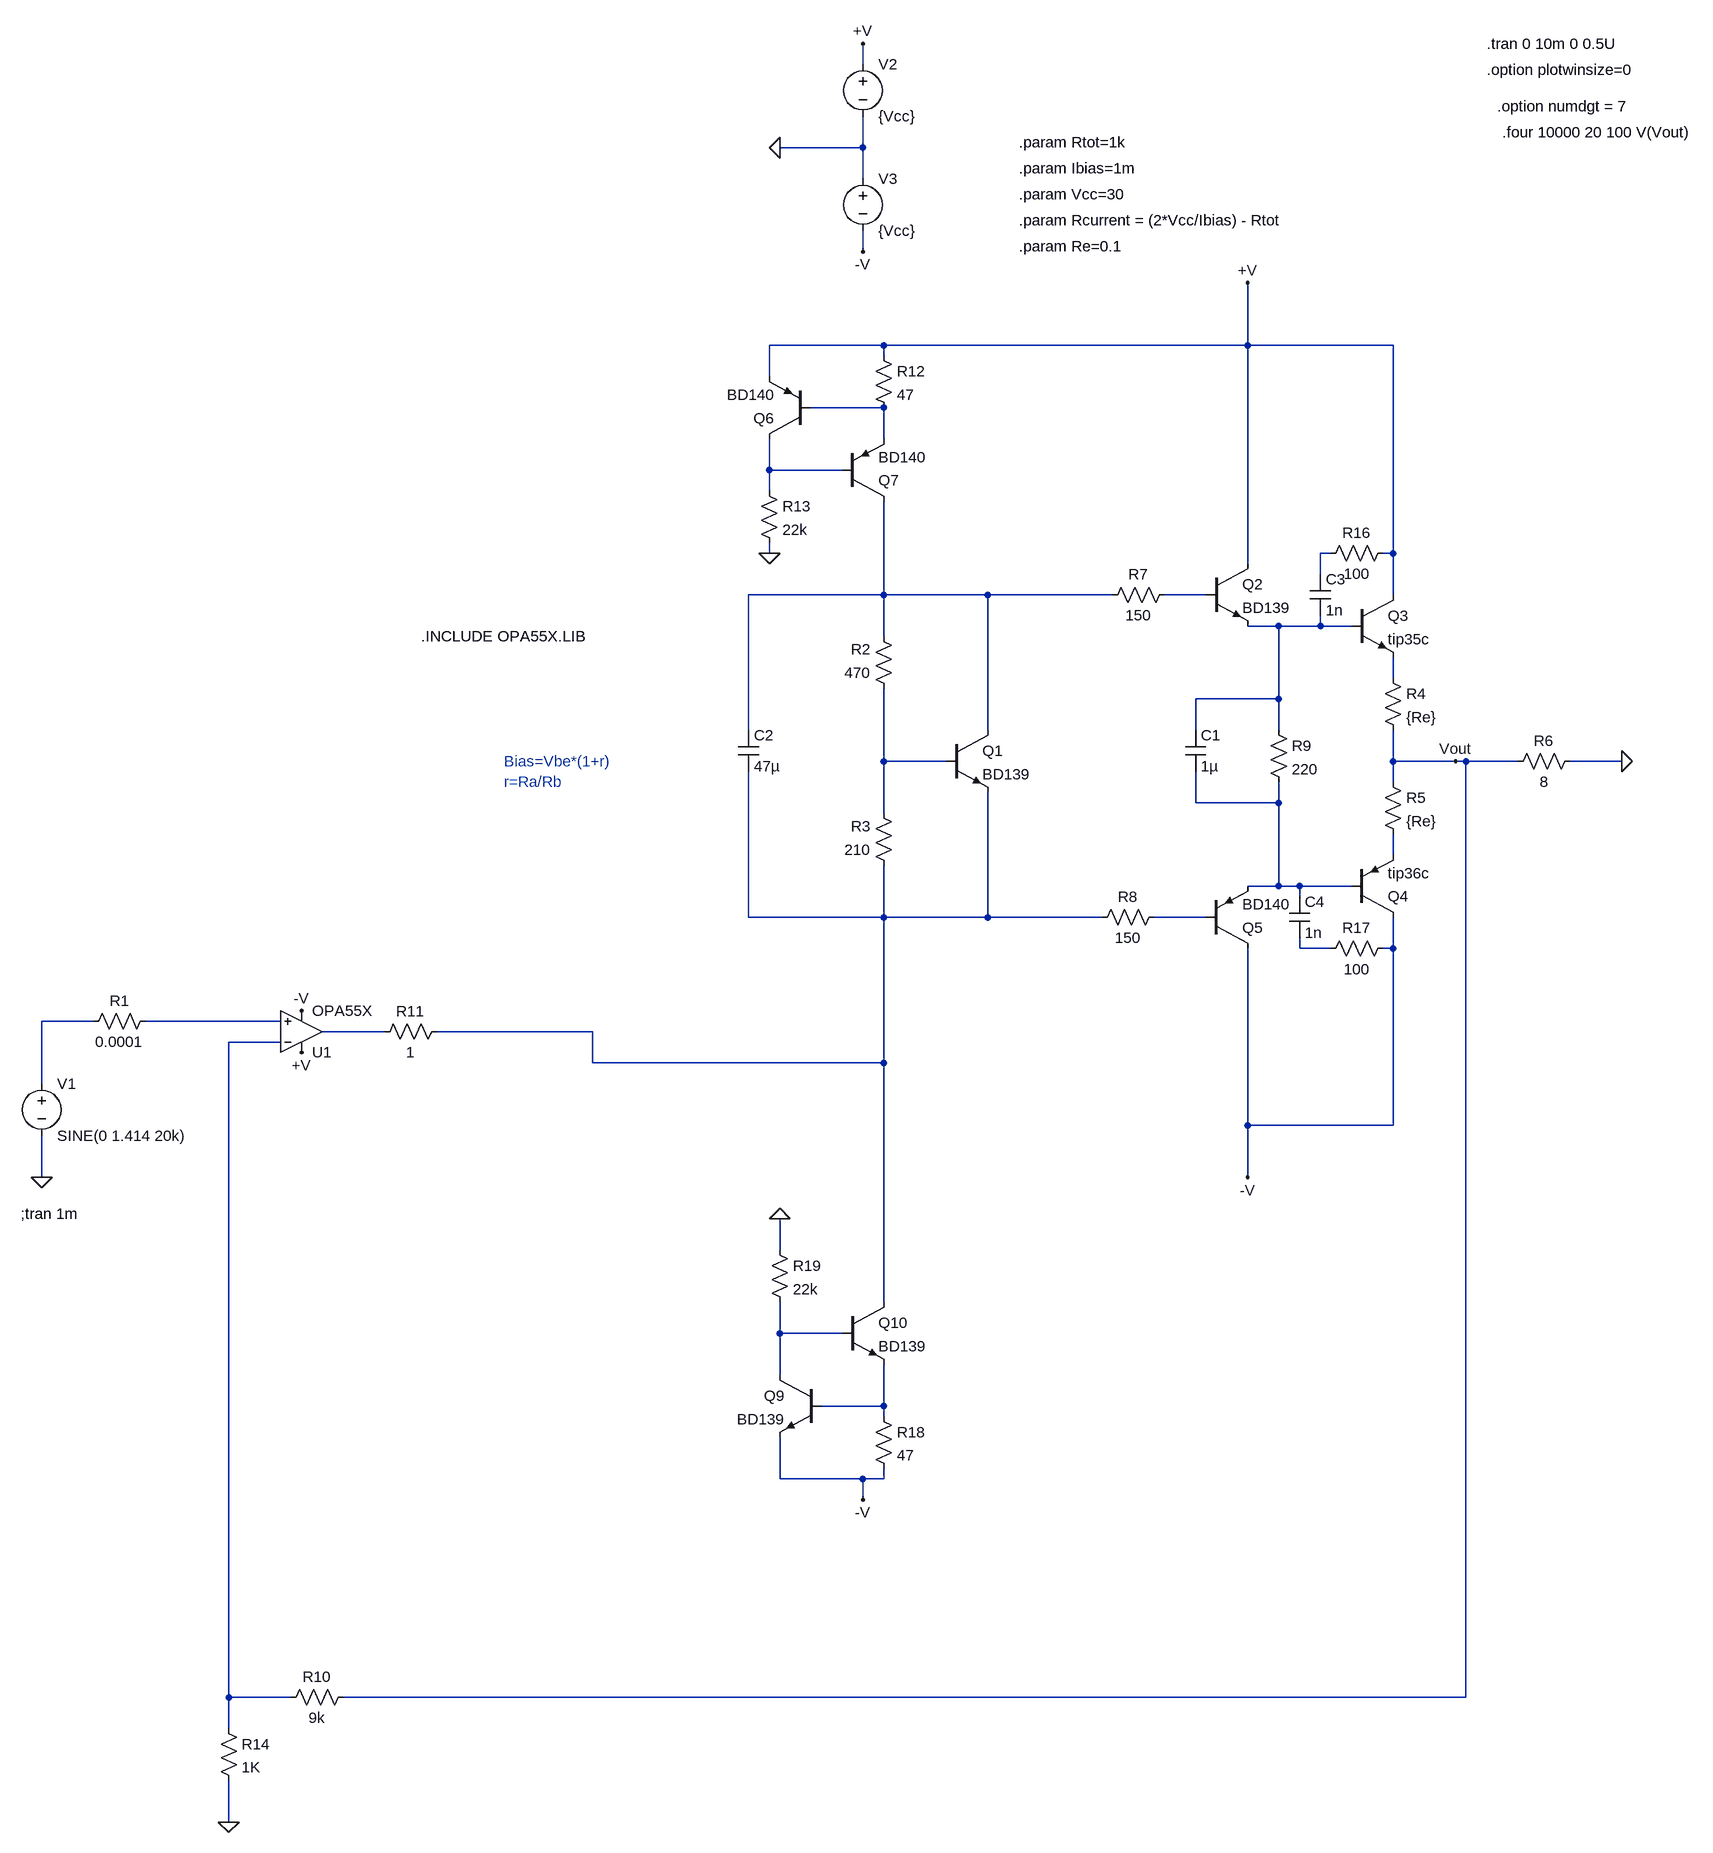
[diagram p0: schematic V3 OFFSET - POWER.asc]
V3 OFFSET - POWER.asc, the LTspice schematic file:
Version 4
SHEET 1 1624 1316
WIRE 320 -2688 320 -2720
WIRE 320 -2560 320 -2608
WIRE 320 -2560 192 -2560
WIRE 320 -2512 320 -2560
WIRE 320 -2400 320 -2432
WIRE 352 -2256 176 -2256
WIRE 912 -2256 912 -2352
WIRE 912 -2256 352 -2256
WIRE 1136 -2256 912 -2256
WIRE 352 -2240 352 -2256
WIRE 176 -2208 176 -2256
WIRE 352 -2160 240 -2160
WIRE 352 -2112 352 -2160
WIRE 176 -2064 176 -2112
WIRE 288 -2064 176 -2064
WIRE 176 -2032 176 -2064
WIRE 176 -1936 176 -1952
WIRE 1040 -1936 1024 -1936
WIRE 1136 -1936 1136 -2256
WIRE 1136 -1936 1120 -1936
WIRE 912 -1920 912 -2256
WIRE 1024 -1904 1024 -1936
WIRE 352 -1872 352 -2016
WIRE 352 -1872 144 -1872
WIRE 512 -1872 352 -1872
WIRE 704 -1872 512 -1872
WIRE 848 -1872 784 -1872
WIRE 1136 -1872 1136 -1936
WIRE 960 -1824 912 -1824
WIRE 1024 -1824 1024 -1840
WIRE 1024 -1824 960 -1824
WIRE 1072 -1824 1024 -1824
WIRE 352 -1808 352 -1872
WIRE 1136 -1744 1136 -1776
WIRE 960 -1712 960 -1824
WIRE 960 -1712 832 -1712
WIRE 144 -1664 144 -1872
WIRE 512 -1664 512 -1872
WIRE 832 -1664 832 -1712
WIRE 960 -1664 960 -1712
WIRE 352 -1616 352 -1728
WIRE 448 -1616 352 -1616
WIRE 1136 -1616 1136 -1664
WIRE 1232 -1616 1136 -1616
WIRE 1248 -1616 1232 -1616
WIRE 1328 -1616 1248 -1616
WIRE 1488 -1616 1408 -1616
WIRE 1136 -1584 1136 -1616
WIRE 832 -1552 832 -1600
WIRE 960 -1552 960 -1584
WIRE 960 -1552 832 -1552
WIRE 352 -1536 352 -1616
WIRE 1136 -1472 1136 -1504
WIRE 960 -1424 960 -1552
WIRE 960 -1424 912 -1424
WIRE 992 -1424 960 -1424
WIRE 1072 -1424 992 -1424
WIRE 992 -1408 992 -1424
WIRE 144 -1376 144 -1600
WIRE 352 -1376 352 -1456
WIRE 352 -1376 144 -1376
WIRE 512 -1376 512 -1568
WIRE 512 -1376 352 -1376
WIRE 688 -1376 512 -1376
WIRE 848 -1376 768 -1376
WIRE 992 -1328 992 -1344
WIRE 1040 -1328 992 -1328
WIRE 1136 -1328 1136 -1376
WIRE 1136 -1328 1120 -1328
WIRE -864 -1216 -944 -1216
WIRE -576 -1216 -784 -1216
WIRE -416 -1200 -512 -1200
WIRE -96 -1200 -336 -1200
WIRE -576 -1184 -656 -1184
WIRE -96 -1152 -96 -1200
WIRE 352 -1152 352 -1376
WIRE 352 -1152 -96 -1152
WIRE -944 -1120 -944 -1216
WIRE 912 -1056 912 -1328
WIRE 1136 -1056 1136 -1328
WIRE 1136 -1056 912 -1056
WIRE -944 -976 -944 -1040
WIRE 912 -976 912 -1056
WIRE 192 -864 192 -912
WIRE 352 -784 352 -1152
WIRE 192 -736 192 -784
WIRE 288 -736 192 -736
WIRE 192 -672 192 -736
WIRE 352 -624 352 -688
WIRE 352 -624 256 -624
WIRE 352 -608 352 -624
WIRE 192 -512 192 -576
WIRE 320 -512 192 -512
WIRE 352 -512 352 -528
WIRE 352 -512 320 -512
WIRE 320 -480 320 -512
WIRE -656 -176 -656 -1184
WIRE -560 -176 -656 -176
WIRE 1248 -176 1248 -1616
WIRE 1248 -176 -480 -176
WIRE -656 -128 -656 -176
WIRE -656 16 -656 -48
FLAG 912 -2352 +V
FLAG 912 -976 -V
FLAG -944 -976 0
FLAG 192 -2560 0
FLAG 320 -2720 +V
FLAG 320 -2400 -V
FLAG 1488 -1616 0
FLAG 1232 -1616 Vout
FLAG -544 -1168 +V
FLAG -544 -1232 -V
FLAG 176 -1936 0
FLAG -656 16 0
FLAG 192 -912 0
FLAG 320 -480 -V
SYMBOL voltage -944 -1136 R0
WINDOW 123 0 0 Left 0
WINDOW 39 0 0 Left 0
SYMATTR InstName V1
SYMATTR Value SINE(0 1.414 20k)
SYMBOL res -768 -1232 R90
WINDOW 0 0 56 VBottom 2
WINDOW 3 32 56 VTop 2
SYMATTR InstName R1
SYMATTR Value 0.0001
SYMBOL res 368 -1712 R180
WINDOW 0 36 76 Left 2
WINDOW 3 36 40 Left 2
SYMATTR InstName R2
SYMATTR Value 470
SYMBOL res 368 -1440 R180
WINDOW 0 36 76 Left 2
WINDOW 3 36 40 Left 2
SYMATTR InstName R3
SYMATTR Value 210
SYMBOL npn 448 -1664 R0
SYMATTR InstName Q1
SYMATTR Value BD139
SYMBOL npn 848 -1920 R0
SYMATTR InstName Q2
SYMATTR Value BD139
SYMBOL npn 1072 -1872 R0
SYMATTR InstName Q3
SYMATTR Value tip35c
SYMBOL pnp 1072 -1376 M180
SYMATTR InstName Q4
SYMATTR Value tip36c
SYMBOL pnp 848 -1328 M180
SYMATTR InstName Q5
SYMATTR Value BD140
SYMBOL res 1120 -1760 R0
SYMATTR InstName R4
SYMATTR Value {Re}
SYMBOL res 1120 -1600 R0
SYMATTR InstName R5
SYMATTR Value {Re}
SYMBOL voltage 320 -2704 R0
WINDOW 123 0 0 Left 0
WINDOW 39 0 0 Left 0
SYMATTR InstName V2
SYMATTR Value {Vcc}
SYMBOL voltage 320 -2528 R0
WINDOW 123 0 0 Left 0
WINDOW 39 0 0 Left 0
SYMATTR InstName V3
SYMATTR Value {Vcc}
SYMBOL res 1424 -1632 R90
WINDOW 0 0 56 VBottom 2
WINDOW 3 32 56 VTop 2
SYMATTR InstName R6
SYMATTR Value 8
SYMBOL res 800 -1888 R90
WINDOW 0 0 56 VBottom 2
WINDOW 3 32 56 VTop 2
SYMATTR InstName R7
SYMATTR Value 150
SYMBOL res 784 -1392 R90
WINDOW 0 0 56 VBottom 2
WINDOW 3 32 56 VTop 2
SYMATTR InstName R8
SYMATTR Value 150
SYMBOL res 944 -1680 R0
SYMATTR InstName R9
SYMATTR Value 220
SYMBOL cap 816 -1664 R0
SYMATTR InstName C1
SYMATTR Value 1µ
SYMBOL cap 128 -1664 R0
SYMATTR InstName C2
SYMATTR Value 47µ
SYMBOL OpAmps\\opamp2 -544 -1136 M180
SYMATTR InstName U1
SYMATTR Value OPA55X
SYMBOL res -464 -192 R90
WINDOW 0 0 56 VBottom 2
WINDOW 3 32 56 VTop 2
SYMATTR InstName R10
SYMATTR Value 9k
SYMBOL res -320 -1216 R90
WINDOW 0 0 56 VBottom 2
WINDOW 3 32 56 VTop 2
SYMATTR InstName R11
SYMATTR Value 1
SYMBOL pnp 240 -2112 R180
SYMATTR InstName Q6
SYMATTR Value BD140
SYMBOL res 336 -2256 R0
SYMATTR InstName R12
SYMATTR Value 47
SYMBOL pnp 288 -2016 M180
SYMATTR InstName Q7
SYMATTR Value BD140
SYMBOL res 160 -2048 R0
SYMATTR InstName R13
SYMATTR Value 22k
SYMBOL res -672 -144 R0
SYMATTR InstName R14
SYMATTR Value 1K
SYMBOL cap 1008 -1904 R0
SYMATTR InstName C3
SYMATTR Value 1n
SYMBOL res 1136 -1952 R90
WINDOW 0 0 56 VBottom 2
WINDOW 3 32 56 VTop 2
SYMATTR InstName R16
SYMATTR Value 100
SYMBOL res 1136 -1344 R90
WINDOW 0 0 56 VBottom 2
WINDOW 3 32 56 VTop 2
SYMATTR InstName R17
SYMATTR Value 100
SYMBOL cap 976 -1408 R0
SYMATTR InstName C4
SYMATTR Value 1n
SYMBOL npn 256 -672 M0
SYMATTR InstName Q9
SYMATTR Value BD139
SYMBOL npn 288 -784 R0
SYMATTR InstName Q10
SYMATTR Value BD139
SYMBOL res 336 -624 R0
SYMATTR InstName R18
SYMATTR Value 47
SYMBOL res 176 -880 R0
SYMATTR InstName R19
SYMATTR Value 22k
TEXT -232 -1616 Left 2 ;Bias=Vbe*(1+r)\nr=Ra/Rb
TEXT 560 -2568 Left 2 !.param Rtot=1k
TEXT 560 -2528 Left 2 !.param Ibias=1m
TEXT 560 -2488 Left 2 !.param Vcc=30
TEXT 560 -2448 Left 2 !.param Rcurrent = (2*Vcc/Ibias) - Rtot
TEXT 560 -2408 Left 2 !.param Re=0.1
TEXT -976 -920 Left 2 !;tran 1m
TEXT 1280 -2720 Left 2 !.tran 0 10m 0 0.5U
TEXT 1280 -2680 Left 2 !.option plotwinsize=0
TEXT 1296 -2624 Left 2 !.option numdgt = 7
TEXT 1304 -2584 Left 2 !.four 10000 20 100 V(Vout)
TEXT -360 -1808 Left 2 !.INCLUDE OPA55X.LIB

The netlist it stands for:
* V3 OFFSET - POWER.asc
V1 N014 0 SINE(0 1.414 20k)
R1 N015 N014 0.0001
R2 N008 N004 470
R3 N011 N008 210
Q1 N004 N008 N011 0 BD139
Q2 +V N005 N006 0 BD139
Q3 +V N006 N007 0 tip35c
Q4 -V N009 N010 0 tip36c
Q5 -V N012 N009 0 BD140
R4 N007 Vout {Re}
R5 Vout N010 {Re}
V2 +V 0 {Vcc}
V3 0 -V {Vcc}
R6 0 Vout 8
R7 N005 N004 150
R8 N012 N011 150
R9 N006 N009 220
C1 N006 N009 1µ
C2 N004 N011 47µ
XU1 N015 N017 +V -V N016 OPA55X  ; pins In+ In- V+ V- OUT
R10 Vout N017 9k
R11 N011 N016 1
Q6 N002 N001 +V 0 BD140
R12 +V N001 47
Q7 N004 N002 N001 0 BD140
R13 N002 0 22k
R14 N017 0 1K
C3 N003 N006 1n
R16 +V N003 100
R17 -V N013 100
C4 N009 N013 1n
Q9 N018 N019 -V 0 BD139
Q10 N011 N018 N019 0 BD139
R18 N019 -V 47
R19 0 N018 22k
.model NPN NPN
.model PNP PNP
.lib standard.bjt
* Bias=Vbe*(1+r)
* r=Ra/Rb
.param Rtot=1k
.param Ibias=1m
.param Vcc=30
.param Rcurrent = (2*Vcc/Ibias) - Rtot
.param Re=0.1
;tran 1m
.tran 0 10m 0 0.5U
.option plotwinsize=0
.option numdgt = 7
.four 10000 20 100 V(Vout)
.INCLUDE OPA55X.LIB
.backanno
.end